# EAGLE design tempctrl_tmp300_eagle5 (EAGLE 5.06)
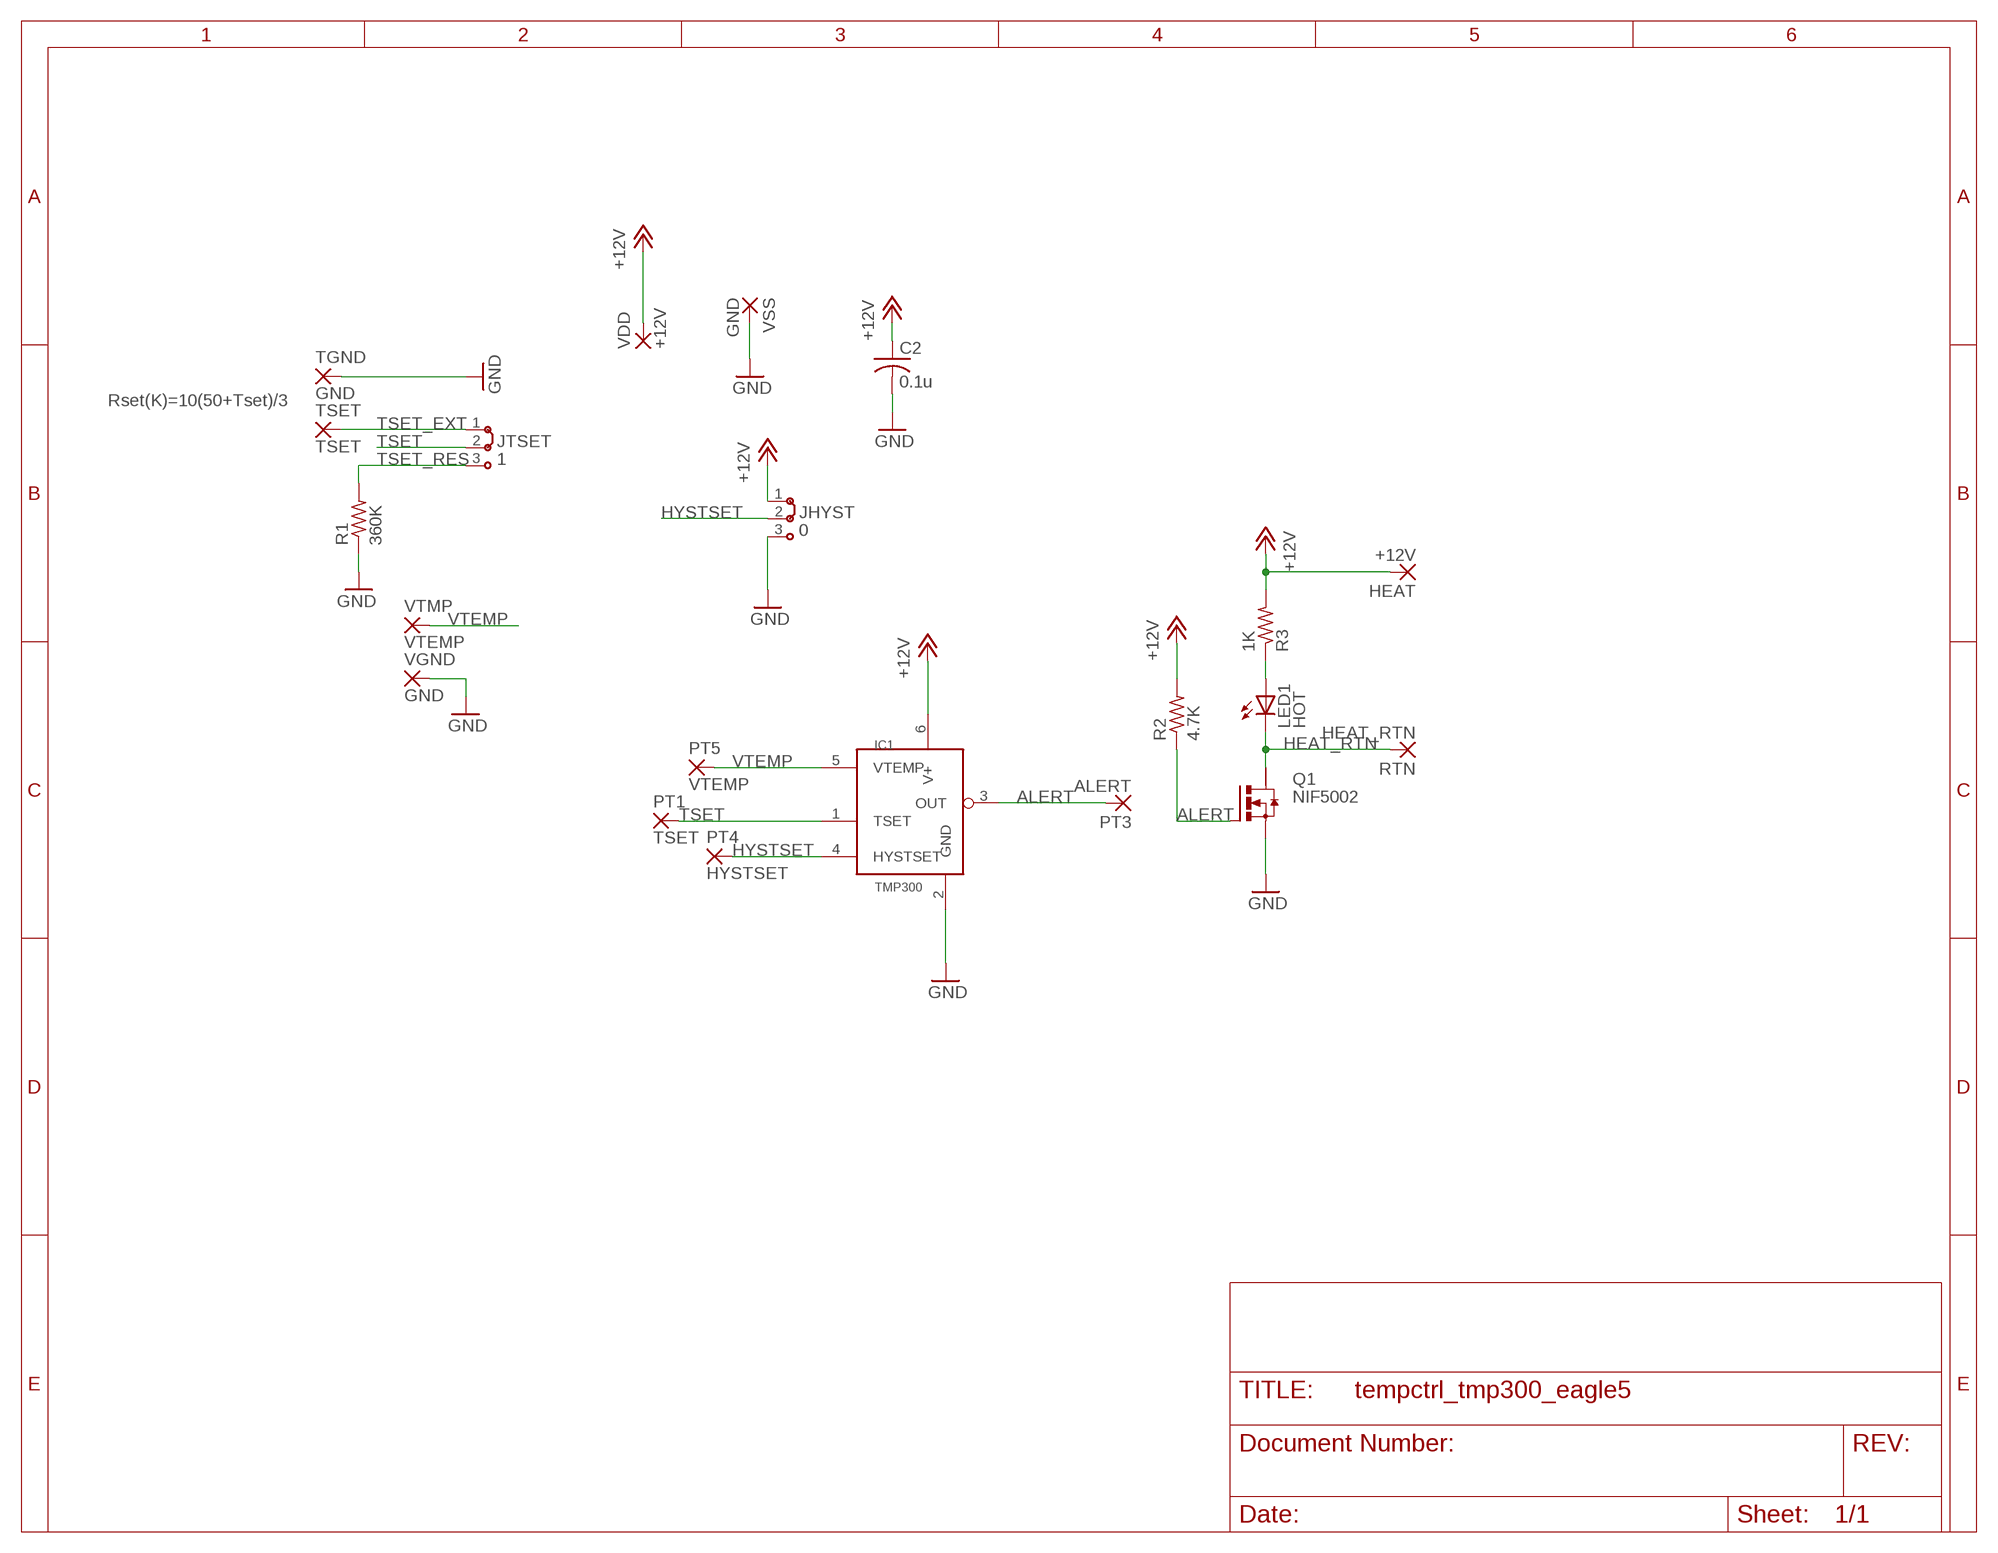
[diagram p0: schematic, sheet 1]

## Parts
C2  0.1u  C-USC1206  [C1206]
HEAT  +12V  2,54/1,1  [2,54/1,1]
IC1  TMP300  [SOT23-6]
JHYST  0  J2X2MM  [04C]
JTSET  1  J2X2MM  [04C]
LED1  HOT  LED1206  [LED-1206]
PT1  TSET  1,6/0,9  [1,6/0,9]
PT3  ALERT  1,6/0,9  [1,6/0,9]
PT4  HYSTSET  1,6/0,9  [1,6/0,9]
PT5  VTEMP  1,6/0,9  [1,6/0,9]
Q1  NIF5002  N-HEXFET-2D_SOT232-  [SOT223]
R1  360K  R-US_R1206  [R1206]
R2  4.7K  R-US_R1206  [R1206]
R3  1K  R-US_R1206  [R1206]
RTN  HEAT_RTN  2,54/1,1  [2,54/1,1]
TGND  GND  2,54/1,0  [2,54/1,0]
TSET  TSET  2,54/1,0  [2,54/1,0]
VDD  +12V  2,54/1,0  [2,54/1,0]
VGND  GND  2,54/1,0  [2,54/1,0]
VSS  GND  2,54/1,0  [2,54/1,0]
VTMP  VTEMP  2,54/1,0  [2,54/1,0]

## Nets
+12V: C2.1 HEAT.1(P) IC1.6(V+) JHYST.1 R2.2 R3.2 VDD.1(P)
ALERT: IC1.3(OUT) PT3.1(P) Q1.1(G) R2.1
GND: C2.2 IC1.2(GND) JHYST.3 Q1.3(S) R1.1 TGND.1(P) VGND.1(P) VSS.1(P)
HEAT_RTN: LED1.C Q1.2(D) RTN.1(P)
HYSTSET: IC1.4(HYSTSET) JHYST.2 PT4.1(P)
N$4: LED1.A R3.1
TSET: IC1.1(TSET) JTSET.2 PT1.1(P)
TSET_EXT: JTSET.1 TSET.1(P)
TSET_RES: JTSET.3 R1.2
VTEMP: IC1.5(VTEMP) PT5.1(P) VTMP.1(P)
Unconnected: Q1.4(D)

## Notes on the sheet
- Rset(K)=10(50+Tset)/3

## Library data of the parts
C2 = resistor:C-US: CAPACITOR, American symbol
HEAT RTN = wirepad:2,54/1,1: THROUGH-HOLE PAD
IC1 = clothbot:TMP300
JHYST JTSET = jumper:J2: Jumper switch 2 x 2.5 mm
LED1 = sparkfun:LED: LEDs Standard schematic elements and footprints for 5mm, 3mm, 1206, and 0603 sized LEDs. 5mm - Spark Fun Electronics SKU : COM-00529 (and others)
PT1 PT3-PT5 = wirepad:1,6/0,9: THROUGH-HOLE PAD
Q1 = clothbot:N-HEXFET-2D_?-*: HEXFET® Power MOSFET 2 Drain connects http://www.irf.com/product-info/datasheets/data/irll014n.pdf
R1-R3 = resistor:R-US_: RESISTOR, American symbol
TGND TSET VDD VGND VSS VTMP = wirepad:2,54/1,0: THROUGH-HOLE PAD

## Board
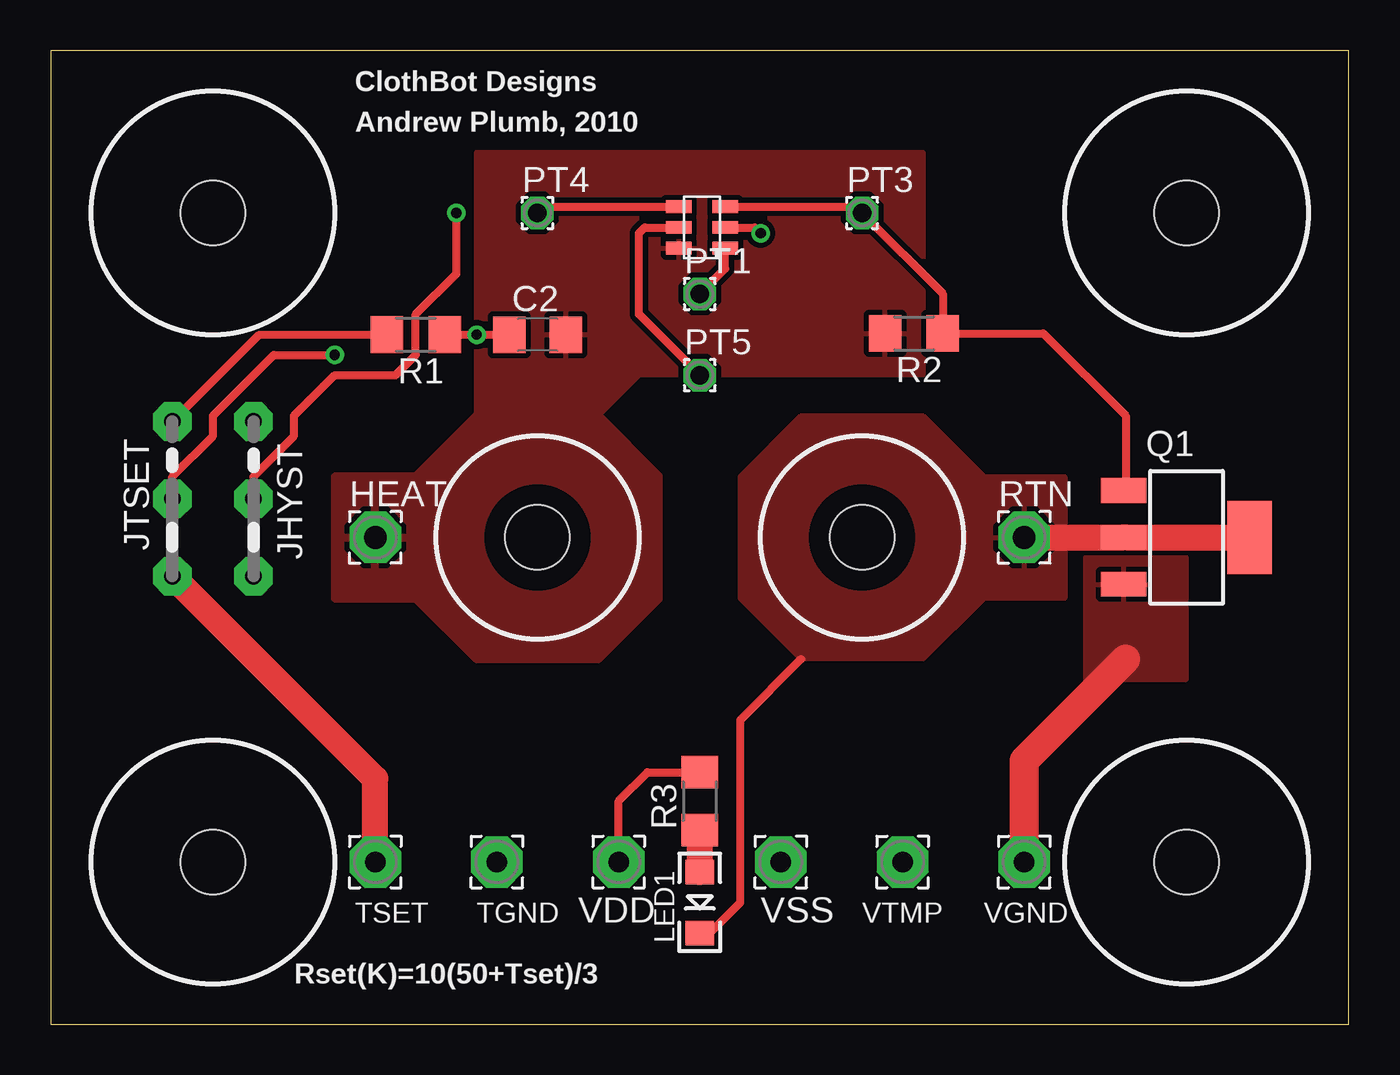
[diagram p1: board, top side]
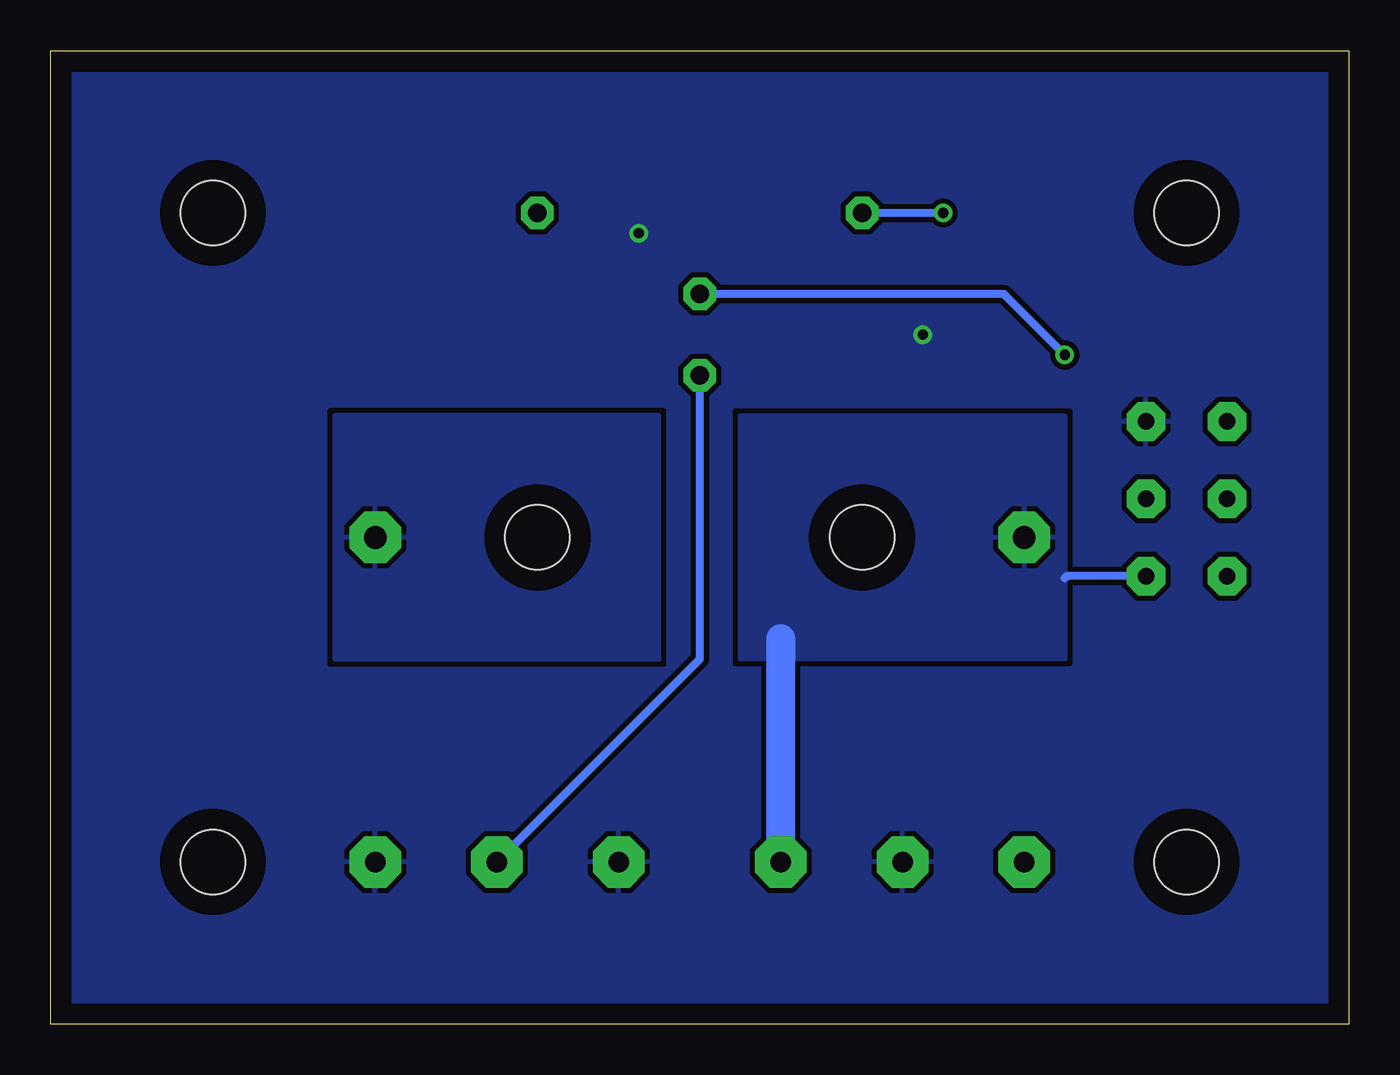
[diagram p2: board, bottom side, seen from below]

Size 64 x 48 mm. Coordinates in mm from the lower left corner, seen from the top.
Outline: 0,0 64,0 64,48 0,48 0,0
Copper layers (1*16): Top 0.035mm / dielectric 1.5mm / Bottom 0.035mm
Design rules "default": minimum track width 10mil, minimum drill 24mil, track to track 8mil, track to pad 8mil, pad to pad 8mil, via to via 8mil, smd to smd 8mil, copper to edge 40mil, drill to drill 8mil, minimum pad ring 10mil, minimum via ring 8mil, stop-mask expansion 4mil, vias tented up to drill 0mil, thermal gap 10mil

### Footprints (pad centres in the part's own frame; a part is rotated, then mirrored left to right if it is on the bottom)
C1206 = smd 1.6 x 1.8: 1 -1.4,0; 2 1.4,0
2,54/1,1 = drill 1.118 pad 2.54 octagon: 1 0,0
SOT23-6 = smd 0.635 x 1.27: 1 1.27,-0.254; 2 2.286,-0.254; 3 3.302,-0.254; 4 3.302,2.032; 5 2.286,2.032; 6 1.27,2.032
04C = drill 0.813 pad 1.905 octagon: 1 -1.905,0; 2 1.905,0; 3 5.715,0
LED-1206 = smd 1.2 x 1.4: A -1.5,0; C 1.5,0
1,6/0,9 = drill 0.914 pad 1.6 octagon: 1 0,0
SOT223 = smd 1.219 x 2.235: 1 -2.311,-3.099; 2 0,-3.099; 3 2.311,-3.099 | smd 3.6 x 2.2: 4 0,3.099
R1206 = smd 1.6 x 1.803: 1 -1.422,0; 2 1.422,0
2,54/1,0 = drill 1.016 pad 2.54 octagon: 1 0,0
DRILL_0.1250 = hole 3.175: 0,0

### Placement (x,y rotation side)
C2  24,34 180 top
HEAT  16,24 0 top
IC1  33,37 90 top
JHYST  10,24 90 top
JTSET  6,24 90 top
LED1  32,6 270 top
PT1  32,36 0 top
PT3  40,40 0 top
PT4  24,40 0 top
PT5  32,32 0 top
Q1  56,24 270 top
R1  18,34 180 top
R2  42.56,34.06 180 top
R3  32,11 90 top
RTN  48,24 0 top
TGND  22,8 0 top
TSET  16,8 0 top
U$1  [DRILL_0.1250]  8,40 0 top
U$2  [DRILL_0.1250]  56,40 0 top
U$3  [DRILL_0.1250]  56,8 0 top
U$4  [DRILL_0.1250]  8,8 0 top
U$5  [DRILL_0.1250]  24,24 0 top
U$6  [DRILL_0.1250]  40,24 0 top
VDD  28,8 0 top
VGND  48,8 0 top
VSS  36,8 0 top
VTMP  42,8 0 top

### Tracks (layer width: path | path; a pad name or v marks a point on that pad's centre or on a via)
+12V
  Top 0.406: R3.2 29.42,12.42 28,11 VDD.1
  Bottom 0.406: JHYST.1 13.9,22.09 14,22
  Bottom 1.422: VDD.1 28,19
  pour Bottom (isolate 0.254): 30,30 14,30 14,18 30,18
  pour Top: 30,27 27,30 21,30 18,27 14,27 14,21 18,21 21,18 27,18 30,21
  pour Top (isolate 0.254): 21,30 21,43 43,43 43,32 35,32 29,32 27,30
ALERT
  Top 0.406: IC1.3 39.7,40.3 PT3.1 43.98,36.02 R2.1 48.94,34.06 53,30 53,26.41 Q1.1
GND  (via drill 0.51)
  Top 0.406: IC1.2 34.71,39.29 v35,39 | R1.1 v21,34 C2.2
  Top 1.422: VGND.1 48,13 53,18
  pour Bottom (isolate 0.254, rank 2): 1,47 1,1 63,1 63,47
  pour Top: 51,23 51,17 56,17 56,23
HEAT_RTN
  Top 0.406: LED1.C 32.5,4.5 34,6 34,15 37,18
  Top 1.27: RTN.1 Q1.2
  pour Bottom (isolate 0.254): 34,30 50,30 50,18 34,18
  pour Top: 34,27 37,30 43,30 46,27 50,27 50,21 46,21 43,18 37,18 34,21
HYSTSET  (via drill 0.51)
  Top 0.406: IC1.4 24.3,40.3 PT4.1 | JHYST.2 10,27 12,29 12,30 14,32 17,32 18,33 18,35 20,37 v20,40
  Bottom 0.406: v20,40 PT4.1
N$2
  Top 1.27: 53,24 59,24
N$4
  Top 1.27: LED1.A R3.1
TSET  (via drill 0.51)
  Top 0.406: IC1.1 33.25,37.25 PT1.1 | JTSET.2 6,27 8,29 8,30 11,33 v14,33
  Bottom 0.406: v14,33 17,36 PT1.1
TSET_EXT
  Top 1.27: TSET.1 16,12.1 JTSET.1
TSET_RES
  Top 0.406: JTSET.3 10.29,34 R1.2
VTEMP
  Top 0.406: IC1.5 29.29,39.29 29,39 29,35 PT5.1
  Bottom 0.406: PT5.1 32,18 VTMP.1

### Text on the board
tNames: ClothBot Designs | Andrew Plumb, 2010 | Rset(K)=10(50+Tset)/3